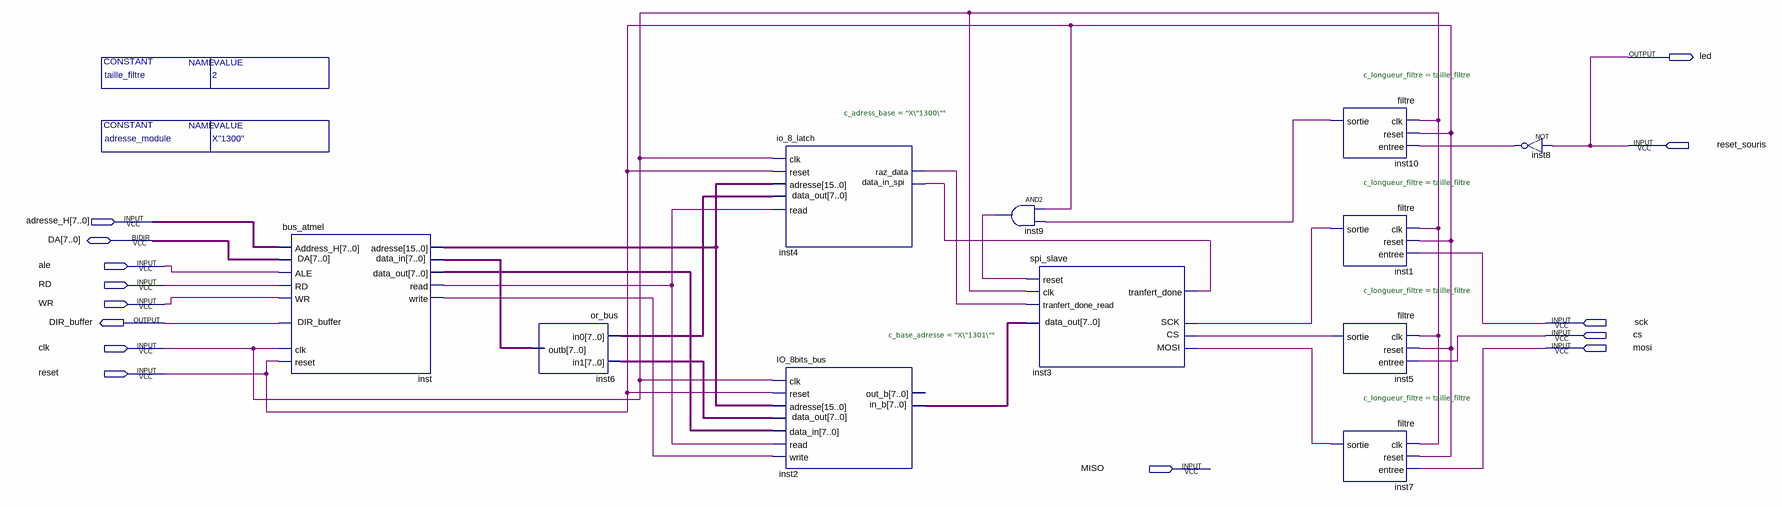
[diagram p0: schematic sheet]
// Quartus schematic test_souris_laser_unioc.bdf as structural Verilog: 11 symbols, 14 pins
module test_souris_laser_unioc #(parameter adresse_module = "X\"1300\"", parameter taille_filtre = 2) (
  input  reset_souris,
  input  [7:0] adresse_H,
  input  ale,
  input  RD,
  input  WR,
  input  sck,
  input  cs,
  input  clk,
  input  mosi,
  input  reset,
  input  MISO,
  inout  [7:0] DA,
  output led,
  output DIR_buffer
);

  wire inst1_sortie, inst3_tranfert_done, inst4_raz_data, inst5_sortie, inst7_sortie, inst8_out, inst9_out,
       inst10_sortie, inst_read, inst_write;
  wire [7:0] inst2_data_out, inst3_data_out, inst4_data_out, inst6_outb, inst_data_out;
  wire [15:0] inst_adresse;

  bus_atmel inst (
    .clk(clk), .reset(reset), .Address_H(adresse_H), .RD(RD), .WR(WR), .ALE(ale), .data_in(inst6_outb),
    .DIR_buffer(DIR_buffer), .adresse(inst_adresse), .data_out(inst_data_out), .read(inst_read),
    .write(inst_write), .DA(DA));
  or_bus inst6 (.in0(inst4_data_out), .in1(inst2_data_out), .outb(inst6_outb));
  io_8_latch #(.c_adress_base("X\"1300\"")) inst4 (
    .clk(clk), .reset(reset), .adresse(inst_adresse), .read(inst_read), .data_in_spi(inst3_tranfert_done),
    .data_out(inst4_data_out), .raz_data(inst4_raz_data));
  IO_8bits_bus #(.c_base_adresse("X\"1301\"")) inst2 (
    .clk(clk), .reset(reset), .adresse(inst_adresse), .data_in(inst_data_out), .read(inst_read),
    .write(inst_write), .in_b(inst3_data_out), .data_out(inst2_data_out));  // open: out_b
  and inst9 (inst9_out, reset, inst10_sortie);
  spi_slave inst3 (
    .reset(inst9_out), .clk(clk), .tranfert_done_read(inst4_raz_data), .MOSI(inst7_sortie),
    .CS(inst5_sortie), .SCK(inst1_sortie), .data_out(inst3_data_out), .tranfert_done(inst3_tranfert_done));
  filtre #(.c_longueur_filtre(taille_filtre)) inst10 (
    .clk(clk), .reset(reset), .entree(inst8_out), .sortie(inst10_sortie));
  filtre #(.c_longueur_filtre(taille_filtre)) inst1 (.clk(clk), .reset(reset), .entree(sck), .sortie(inst1_sortie));
  filtre #(.c_longueur_filtre(taille_filtre)) inst5 (.clk(clk), .reset(reset), .entree(cs), .sortie(inst5_sortie));
  filtre #(.c_longueur_filtre(taille_filtre)) inst7 (.clk(clk), .reset(reset), .entree(mosi), .sortie(inst7_sortie));
  not inst8 (inst8_out, reset_souris);

  assign led = reset_souris;
endmodule
